# EAGLE design Device (EAGLE 9.6.2)
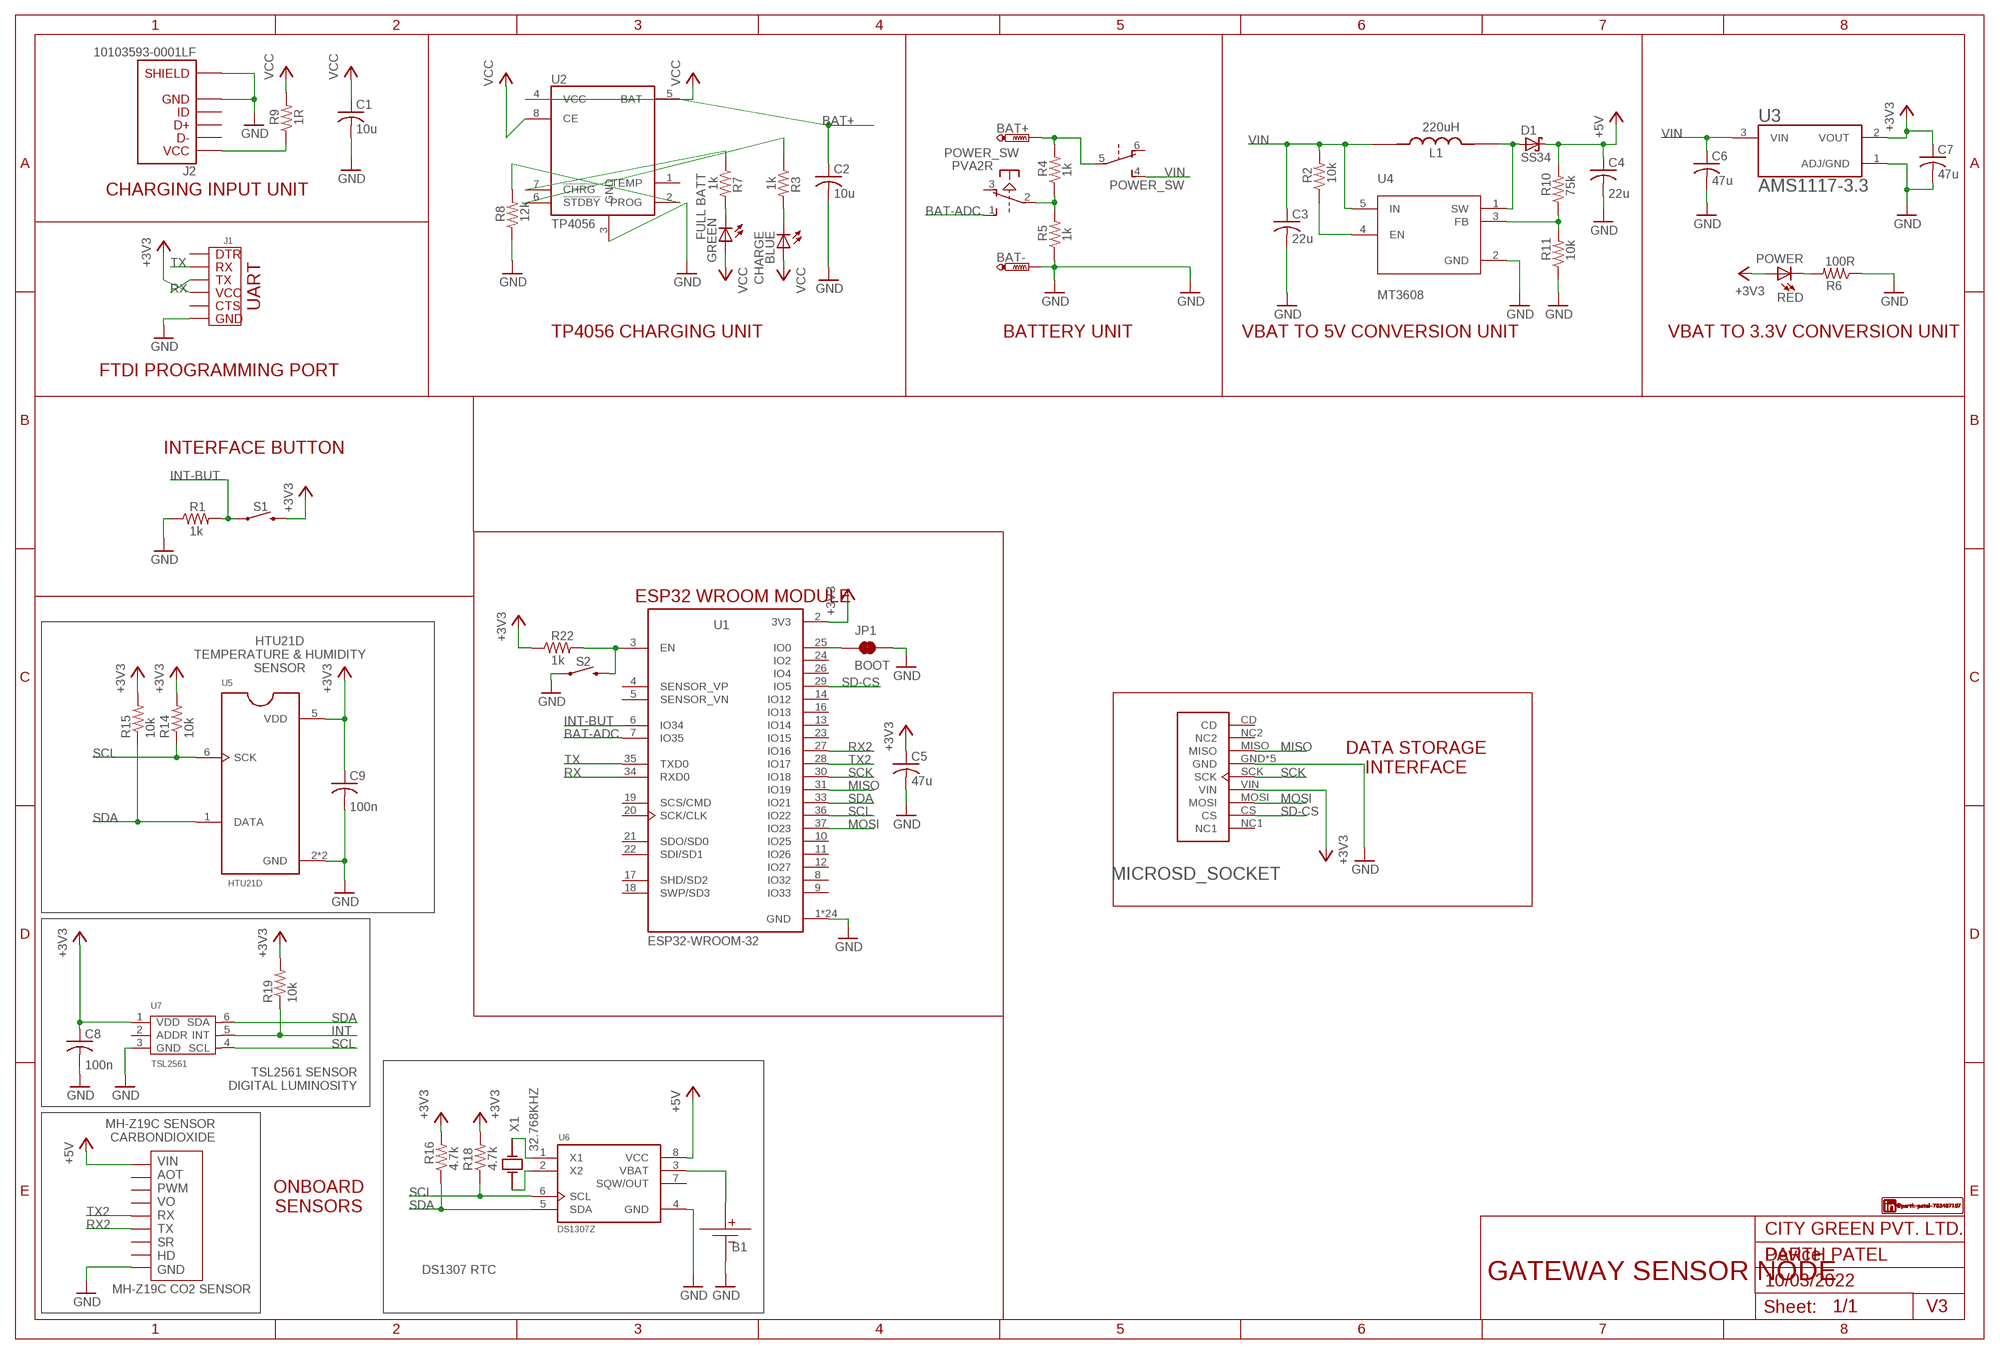
[diagram p0: schematic, sheet 1]

## Parts
B1  CR3032-METAL  [CR2032-METAL]
BAT+  PTR1TP20SQ  [TP20SQ]
BAT-  PTR1TP20SQ  [TP20SQ]
BLUE  CHARGE  LEDCHIP-LED0603  [CHIP-LED0603]
C1  10u  C-USC0805  [C0805]
C2  10u  C-USC0805  [C0805]
C3  22u  C-USC0805  [C0805]
C4  22u  C-USC0805  [C0805]
C5  47u  C-USC0805  [C0805]
C6  47u  C-USC0805  [C0805]
C7  47u  C-USC0805  [C0805]
C8  100n  C-USC0805  [C0805]
C9  100n  C-USC0805  [C0805]
D1  SS34  [DO214]
GREEN  FULL BATT  LEDCHIP-LED0603  [CHIP-LED0603]
J1  UART  [UART]
J2  10103593-0001LF  [AMPHENOL_10103593-0001LF]
JP1  BOOT  JUMPER-SMT_2_NC_TRACE_NO-SILK  [SMT-JUMPER_2_NC_TRACE_NO-SILK]
L1  220uH  #B953AS-221M=P3  [IND_#B953AS-221M=P3]
MICROSD_SOCKET  ST-TF-003A  [SUNTECH_ST-TF-003A]
POWER_SW  PVA2R  [PVA2R]
R1  1k  R-US_R0805  [R0805]
R2  10k  R-US_R0805  [R0805]
R3  1k  R-US_R0805  [R0805]
R4  1k  R-US_R0805  [R0805]
R5  1k  R-US_R0805  [R0805]
R6  100R  R-US_R0805  [R0805]
R7  1k  R-US_R0805  [R0805]
R8  12k  R-US_R0805  [R0805]
R9  1R  R-US_R0805  [R0805]
R10  75k  R-US_R0805  [R0805]
R11  10k  R-US_R0805  [R0805]
R14  10k  R-US_R0805  [R0805]
R15  10k  R-US_R0805  [R0805]
R16  4.7k  R-US_R0805  [R0805]
R18  4.7k  R-US_R0805  [R0805]
R19  10k  R-US_R0805  [R0805]
R22  1k  R-US_R0805  [R0805]
RED  POWER  LEDCHIP-LED0603  [CHIP-LED0603]
S1  MOMENTARY-SWITCH-SPST-SMD-6.2MM-TALL  [TACTILE_SWITCH_SMD_6.2MM_TALL]
S2  RST  MOMENTARY-SWITCH-SPST-SMD-6.2MM-TALL  [TACTILE_SWITCH_SMD_6.2MM_TALL]
U1  ESP32-WROOM-32  [MODULE_ESP32-WROOM-32]
U2  TP4056  [SOP127P600X175-9N]
U3  AMS1117-3.3  [SOT229P700X180-4N]
U4  MT3608  [SOT95P280X145-6N]
U5  HTU21D  [QFN100P300X300X100-7N]
U6  DS1307Z  [SOIC127P600X175-8N]
U7  TSL2561  OPTICAL-TSL2561T(6P-3.8X2.6MM)  [TMB6-1.55-3.8X2.6MM]
U$1  MH-Z19C  [MH-Z19C]
X1  32.768KHZ  AB38T-32.768KHZ  [XTAL_AB38T-32.768KHZ]

## Nets
+3V3: C5.1 C7.1 C8.1 C9.1 J1.VCC MICROSD_SOCKET.VIN R14.2 R15.2 R16.2 R18.2 R19.2 R22.1 RED.A S1.B2 U1.2(3V3) U3.2(VOUT) U5.5(VDD) U7.1(VDD)
+5V: C4.1 D1.C R10.2 U6.8(VCC) U$1.VIN
BAT+: BAT+.TP C2.1 POWER_SW.5(2:P) R4.2 U2.5(BAT)
BAT-ADC: POWER_SW.1(1:S) U1.7(IO35)
BAT-ADC-IN: POWER_SW.2(1:P) R4.1 R5.2
GND: B1.-VE1(-VE) B1.-VE2(-VE) BAT-.TP C1.2 C2.2 C3.2 C4.2 C5.2 C6.2 C7.2 C8.2 C9.2 J1.GND J2.5 J2.S1(SHIELD) J2.S2(SHIELD) J2.S3(SHIELD) J2.S4(SHIELD) J2.S5(SHIELD) J2.S6(SHIELD) JP1.2 MICROSD_SOCKET.GND MICROSD_SOCKET.GND2(GND) MICROSD_SOCKET.GND3(GND) MICROSD_SOCKET.GND4(GND) MICROSD_SOCKET.GND5(GND) R1.1 R5.1 R6.1 R8.1 R11.1 S2.A2 U1.1(GND) U1.15(GND) U1.38(GND) U1.39_1(GND) U1.39_2(GND) U1.39_3(GND) U1.39_4(GND) U1.39_5(GND) U1.39_6(GND) U1.39_7(GND) U1.39_8(GND) U1.39_9(GND) U1.39_10(GND) U1.39_11(GND) U1.39_12(GND) U1.39_13(GND) U1.39_14(GND) U1.39_15(GND) U1.39_16(GND) U1.39_17(GND) U1.39_18(GND) U1.39_19(GND) U1.39_20(GND) U1.39_21(GND) U2.3(GND) U3.1(ADJ/GND) U4.2(GND) U5.2(GND) U5.PAD(GND) U6.4(GND) U7.3(GND) U$1.GND
INT: R19.1 U7.5(INT)
INT-BUT: R1.2 S1.A2 U1.6(IO34)
MISO: MICROSD_SOCKET.MISO U1.31(IO19)
MOSI: MICROSD_SOCKET.MOSI U1.37(IO23)
N$1: R8.2 U2.2(PROG)
N$2: R6.2 RED.C
N$3: J2.1 R9.1
N$4: B1.+VE U6.3(VBAT)
N$5: R2.1 U4.4(EN)
N$6: R3.1 U2.6(!STDBY)
N$7: R7.1 U2.7(!CHRG)
N$8: BLUE.C R3.2
N$9: GREEN.C R7.2
N$11: D1.A L1.2 U4.1(SW)
N$12: R10.1 R11.2 U4.3(FB)
N$13: JP1.1 U1.25(IO0)
N$14: U6.2(X2) X1.1
N$15: R22.2 S2.B2 U1.3(EN)
N$16: U6.1(X1) X1.2
RX: J1.TX U1.34(RXD0)
RX2: U1.27(IO16) U$1.TX
SCK: MICROSD_SOCKET.SCK U1.30(IO18)
SCL: R14.1 R18.1 U1.36(IO22) U5.6(SCK) U6.6(SCL) U7.4(SCL)
SD-CS: MICROSD_SOCKET.CS U1.29(IO5)
SDA: R15.1 R16.1 U1.33(IO21) U5.1(DATA) U6.5(SDA) U7.6(SDA)
TX: J1.RX U1.35(TXD0)
TX2: U1.28(IO17) U$1.RX
VCC: BLUE.A C1.1 GREEN.A R9.2 U2.4(VCC) U2.8(CE)
VIN: C3.1 C6.1 L1.1 POWER_SW.4(2:S) R2.2 U3.3(VIN) U4.5(IN)
Unconnected: J1.CTS J1.DTR J2.2 J2.3 J2.4 MICROSD_SOCKET.CD MICROSD_SOCKET.NC1 MICROSD_SOCKET.NC2 POWER_SW.3(1:O) POWER_SW.6(2:O) U1.4(SENSOR_VP) U1.5(SENSOR_VN) U1.8(IO32) U1.9(IO33) U1.10(IO25) U1.11(IO26) U1.12(IO27) U1.13(IO14) U1.14(IO12) U1.16(IO13) U1.17(SHD/SD2) U1.18(SWP/SD3) U1.19(SCS/CMD) U1.20(SCK/CLK) U1.21(SDO/SD0) U1.22(SDI/SD1) U1.23(IO15) U1.24(IO2) U1.26(IO4) U2.1(TEMP) U6.7(SQW/OUT) U7.2(ADDR) U$1.AOT U$1.HD U$1.PWM U$1.SR U$1.VO

## Notes on the sheet
- CHARGING INPUT UNIT
- TP4056 CHARGING UNIT | BATTERY UNIT | VBAT TO 5V CONVERSION UNIT | VBAT TO 3.3V CONVERSION UNIT
- FTDI PROGRAMMING PORT
- INTERFACE BUTTON
- ESP32 WROOM MODULE
- HTU21D
  TEMPERATURE & HUMIDITY
  SENSOR
- DATA STORAGE
  INTERFACE
- TSL2561 SENSOR
  DIGITAL LUMINOSITY
- MH-Z19C SENSOR
  CARBONDIOXIDE
- ONBOARD
  SENSORS
- CITY GREEN PVT. LTD.
- PARTH PATEL
- DS1307 RTC
- GATEWAY SENSOR NODE
- 10/03/2022
- V3

## Library data of the parts
B1 = Battery Holder:CR3032-METAL
BAT+ BAT- = testpad:PTR1: TEST PIN
BLUE GREEN RED = adafruit:LED: LED OSRAM: - CHIPLED LG R971, LG N971, LY N971, LG Q971, LY Q971, LO R971, LY R971 LH N974, LH R974 LS Q976, LO Q976, LY Q976 LO Q996 - Hyper CHIPLED LW Q18S LB Q993, LB Q99A, LB R99A - SideLED LS A670, LO A670, LY A670, LG A670, LP A670 LB A673, LV A673, LT A673, LW A673 LH A674 LY A675 LS A676, LA A676, LO A676, LY A676, LW A676 LS A679, LY A679, LG A679 - Hyper Micro SIDELED® LS Y876, LA Y876, LO Y876, LY Y876 LT Y87S - SmartLED LW L88C, LW L88S LB L89C, LB L89S, LG L890 LS L89K, LO L89K, LY L89K LS L896, LA L896, LO L896, LY L896 - TOPLED LS T670, LO T670, LY T670, LG T670, LP T670 LSG T670, LSP T670, LSY T670, LOP T670, LYG T670 LG T671, LOG T671, LSG T671 LB T673, LV T673, LT T673, LW T673 LH T674 LS T676, LA T676, LO T676, LY T676, LB T676, LH T676, LSB T676, LW T676 LB T67C, LV T67C, LT T67C, LS T67K, LO T67K, LY T67K, LW E67C LS E67B, LA E67B, LO E67B, LY E67B, LB E67C, LV E67C, LT E67C LW T67C LS T679, LY T679, LG T679 LS T770, LO T770, LY T770, LG T770, LP T770 LB T773, LV T773, LT T773, LW T773 LH T774 LS E675, LA E675, LY E675, LS T675 LS T776, LA T776, LO T776, LY T776, LB T776 LHGB T686 LT T68C, LB T68C - Hyper Mini TOPLED® LB M676 - Mini TOPLED Santana® LG M470 LS M47K, LO M47K, LY M47K Source: http://www.osram.convergy.de/
C1-C9 = rcl:C-US: CAPACITOR, American symbol; SPICEPREFIX: C
D1 = SS34:SS34: SS34 Schottky diode http://www.vishay.com/docs/88751/ss32.pdf Check availability <https://pricing.snapeda.com/parts/SS34/ON%20Semiconductor/view-part?ref=eda>; AVAILABILITY: In Stock; DESCRIPTION: Diode Schottky 40 V 3A Surface Mount SMC (DO-214AB); MF: ON Semiconductor; MP: SS34; PACKAGE: SMC-2 ON Semiconductor; PRICE: None; PURCHASE-URL: https://pricing.snapeda.com/search/part/SS34/?ref=eda
J1 = FTDI Adapter:UART
J2 = MicroUSB Type B Socket:10103593-0001LF: Check availability <https://pricing.snapeda.com/parts/10103593-0001LF/AMPHENOL%20ICC%20/%20FCI/view-part?ref=eda>; AVAILABILITY: In Stock; DESCRIPTION: Micro USB 2.0, Input Output Connectors, B TYPE MID-MOUNT; MF: AMPHENOL ICC / FCI; MP: 10103593-0001LF; PACKAGE: None; PRICE: None; PURCHASE-URL: https://pricing.snapeda.com/search/part/10103593-0001LF/?ref=eda
JP1 = SparkFun-Jumpers:JUMPER-SMT_2_NC_TRACE: Normally closed trace jumper This jumper has a trace between two pads so it's normally closed (NC). Use a razor knife to open the connection. For best results follow the IPC guidelines for cutting traces: Cutout at least 0.063 mm (0.005 in). Remove all loose material to clean up the cut area. Seal the cut with an approved epoxy. Reapply solder to reclose the connection.
L1 = SMD Shielded Wire Wound Power Inductor 12mm:#B953AS-221M=P3: Inductor Power Shielded Wirewound 3.9uH 30% 100KHz Ferrite 6A 0.014Ohm DCR 4949 T/R Check availability <https://pricing.snapeda.com/parts/%23B953AS-221M%3DP3/Murata/view-part?ref=eda>; AVAILABILITY: In Stock; DESCRIPTION: Inductor with Inductance: 220uH Tol. +/-20%, Package: 4949 (125125); MF: Murata; MP: #B953AS-221M=P3; PACKAGE: NONSTANDARD; PRICE: None
MICROSD_SOCKET = MicroSD Card Socket:ST-TF-003A: Micro SD Card Socket Check availability <https://pricing.snapeda.com/parts/ST-TF-003A/Suntech/view-part?ref=eda>; AVAILABILITY: Not in stock; DESCRIPTION: Micro SD Card Socket; MF: Suntech; MP: ST-TF-003A; PACKAGE: None; PRICE: None
POWER_SW = switch-misc:PVA2R: ITT SWITCH
R1-R11 R14-R16 R18 R19 R22 = rcl:R-US_: RESISTOR, American symbol; SPICEPREFIX: R
S1 S2 = SparkFun-Switches:MOMENTARY-SWITCH-SPST: Momentary Switch (Pushbutton) - SPST Normally-open (NO) SPST momentary switches (buttons, pushbuttons). Variants PTH-12MM - 12mm square, through-hole Momentary Pushbutton Switch - 12mm Square <https://www.sparkfun.com/products/9190> (COM-09190) PTH-6.0MM, PTH-6.0MM-KIT - 6.0mm square, through-hole Mini Pushbutton Switch <https://www.sparkfun.com/products/97> (COM-00097) KIT package intended for soldering kit's - only one side of pads' copper is exposed. PTH-RIGHT-ANGLE-KIT - Right-angle, through-hole Right Angle Tactile Button <https://www.sparkfun.com/products/10791> - Used on SparkFun BigTime Watch Kit <https://www.sparkfun.com/products/11734> SMD-12MM - 12mm square, surface-mount Tactile Button - SMD (12mm) <https://www.sparkfun.com/products/12993> (COM-12993) Used on SparkFun PicoBoard <https://www.sparkfun.com/products/11888> SMD-4.5MM - 4.5mm Square Trackball Switch Used on SparkFun Blackberry Trackballer Breakout <https://www.sparkfun.com/products/13169> SMD-4.6MMX2.8MM - 4.60mm x 2.80mm, surface mount Used on SparkFun SAMD21 Mini Breakout <https://www.sparkfun.com/products/13664> SMD-5.2MM, SMD-5.2-REDUNDANT - 5.2mm square, surface-mount Mini Pushbutton Switch - SMD <https://www.sparkfun.com/products/8720> (COM-08720) Used on Arduino Pro Mini <https://www.sparkfun.com/products/11114> REDUNDANT package connects both switch circuits together SMD-6.0X3.5MM - 6.0 x 3.5mm, surface mount Momentary Reset Switch SMD <https://www.sparkfun.com/products/8229> (COM-08229) SMD-6.2MM-TALL - 6.2mm square, surface mount Tactile Button - SMD (6mm) <https://www.sparkfun.com/products/12992> Used on SparkFun Digital Sandbox <https://www.sparkfun.com/products/12651> SMD-RIGHT-ANGLE - Right-angle, surface mount Used on SparkFun Block for Intel® Edison - Arduino <https://www.sparkfun.com/products/13036>; PROD_ID: SWCH-11966; SF_SKU: COM-12992
U1 = ESP32 WROOM 32:ESP32-WROOM-32: Bluetooth, WiFi Transceiver Module 2.4GHz ~ 2.5GHz Surface Mount Check availability <https://pricing.snapeda.com/parts/ESP32-WROOM-32/Espressif%20Systems/view-part?ref=eda>; AVAILABILITY: In Stock; DESCRIPTION: Bluetooth, WiFi 802.11b/g/n, Bluetooth v4.2 +EDR, Class 1, 2 and 3 Transceiver Module 2.4GHz ~ 2.5GHz Antenna Not Included, U.FL Surface Mount; MF: Espressif Systems; MP: ESP32-WROOM-32; PACKAGE: Module Espressif Systems; PRICE: None; PURCHASE-URL: https://pricing.snapeda.com/search/part/ESP32-WROOM-32/?ref=eda
U2 = TP4056:TP4056: Complete single cell Li-Ion battery with a constant current / constant voltage linear charger Check availability <https://pricing.snapeda.com/parts/TP4056/NanJing%20Top%20Power%20ASIC%20Corp./view-part?ref=eda>; AVAILABILITY: Not in stock; DESCRIPTION: Complete single cell Li-Ion battery with a constant current / constant voltage linear charger; MF: NanJing Top Power ASIC Corp.; MP: TP4056; PACKAGE: None; PRICE: None
U3 = AMS1117-3.3:AMS1117-3.3: Sot223/Pkg 1-Amp 3.3-Volt Low Drop Out Voltage Regulatator Check availability <https://pricing.snapeda.com/parts/AMS1117-3.3/AMD/view-part?ref=eda>; AVAILABILITY: Not in stock; DESCRIPTION: LDO Voltage Regulators 800MA LDO LINEAR REG; MF: AMD; MP: AMS1117-3.3; PACKAGE: None; PRICE: None
U4 = MT3608:MT3608: High Efficiency 1.2MHz 2A Step Up Converter Check availability <https://pricing.snapeda.com/parts/MT3608/Aerosemi%20Technology%20Co.%2C%20Ltd/view-part?ref=eda>; AVAILABILITY: Not in stock; DESCRIPTION: High Efficiency 1.2MHz 2A Step Up Converter; MF: Aerosemi Technology Co., Ltd; MP: MT3608; PACKAGE: Package; PRICE: None
U5 = HTU21D:HTU21D: Digital Relative Humidity sensor with Temperature output Check availability <https://pricing.snapeda.com/parts/HTU21D/TE%20Connectivity/view-part?ref=eda>; AVAILABILITY: In Stock; COMMENT: CAT-HSC0004; DESCRIPTION: HTU21D Humidity, Temperature Sensor Xplained Pro Platform Evaluation Expansion Board; MF: TE Connectivity; MP: HTU21D; PACKAGE: DFN-6 TE Connectivity; PRICE: None; PURCHASE-URL: https://pricing.snapeda.com/search/part/HTU21D/?ref=eda
U6 = DS1307Z:DS1307Z: Real Time Clock Serial 56Byte 8-Pin SOIC N Check availability <https://pricing.snapeda.com/parts/DS1307Z/Maxim%20Integrated/view-part?ref=eda>; AVAILABILITY: In Stock; DESCRIPTION: Real Time Clock (RTC) IC Clock/Calendar 56B I²C, 2-Wire Serial 8-SOIC (0.154, 3.90mm Width); MF: Maxim Integrated; MP: DS1307Z; PACKAGE: SOIC-8 Maxim; PRICE: None; PURCHASE-URL: https://pricing.snapeda.com/search/part/DS1307Z/?ref=eda
U7 = TSL2561 LUX Sensor:OPTICAL-TSL2561T(6P-3.8X2.6MM): 314020025 Check availability <https://pricing.snapeda.com/parts/TSL2561T/ams/view-part?ref=eda>; AVAILABILITY: Not in stock; DESCRIPTION: Optical Sensor Ambient 640nm I²C 6-SMD, No Lead; MF: ams; MP: TSL2561T; PACKAGE: SMD-6 TAOS; PRICE: None
U$1 = MH-Z19 Sensor:MH-Z19C
X1 = 32.768KHZ:AB38T-32.768KHZ: AB38T Series 32.768 kHz ±20 ppm 12.5 pF -10 to +60 °C Tuning Fork Crystal Check availability <https://pricing.snapeda.com/parts/AB38T-32.768KHZ/Abracon/view-part?ref=eda>; AVAILABILITY: In Stock; DESCRIPTION: 32.768 kHz ±20ppm Crystal 12.5pF 30 kOhms Cylindrical Can, Radial; MF: Abracon; MP: AB38T-32.768KHZ; PACKAGE: Cylindrical Can Radial Abracon; PRICE: None; PURCHASE-URL: https://pricing.snapeda.com/search/part/AB38T-32.768KHZ/?ref=eda

## Board
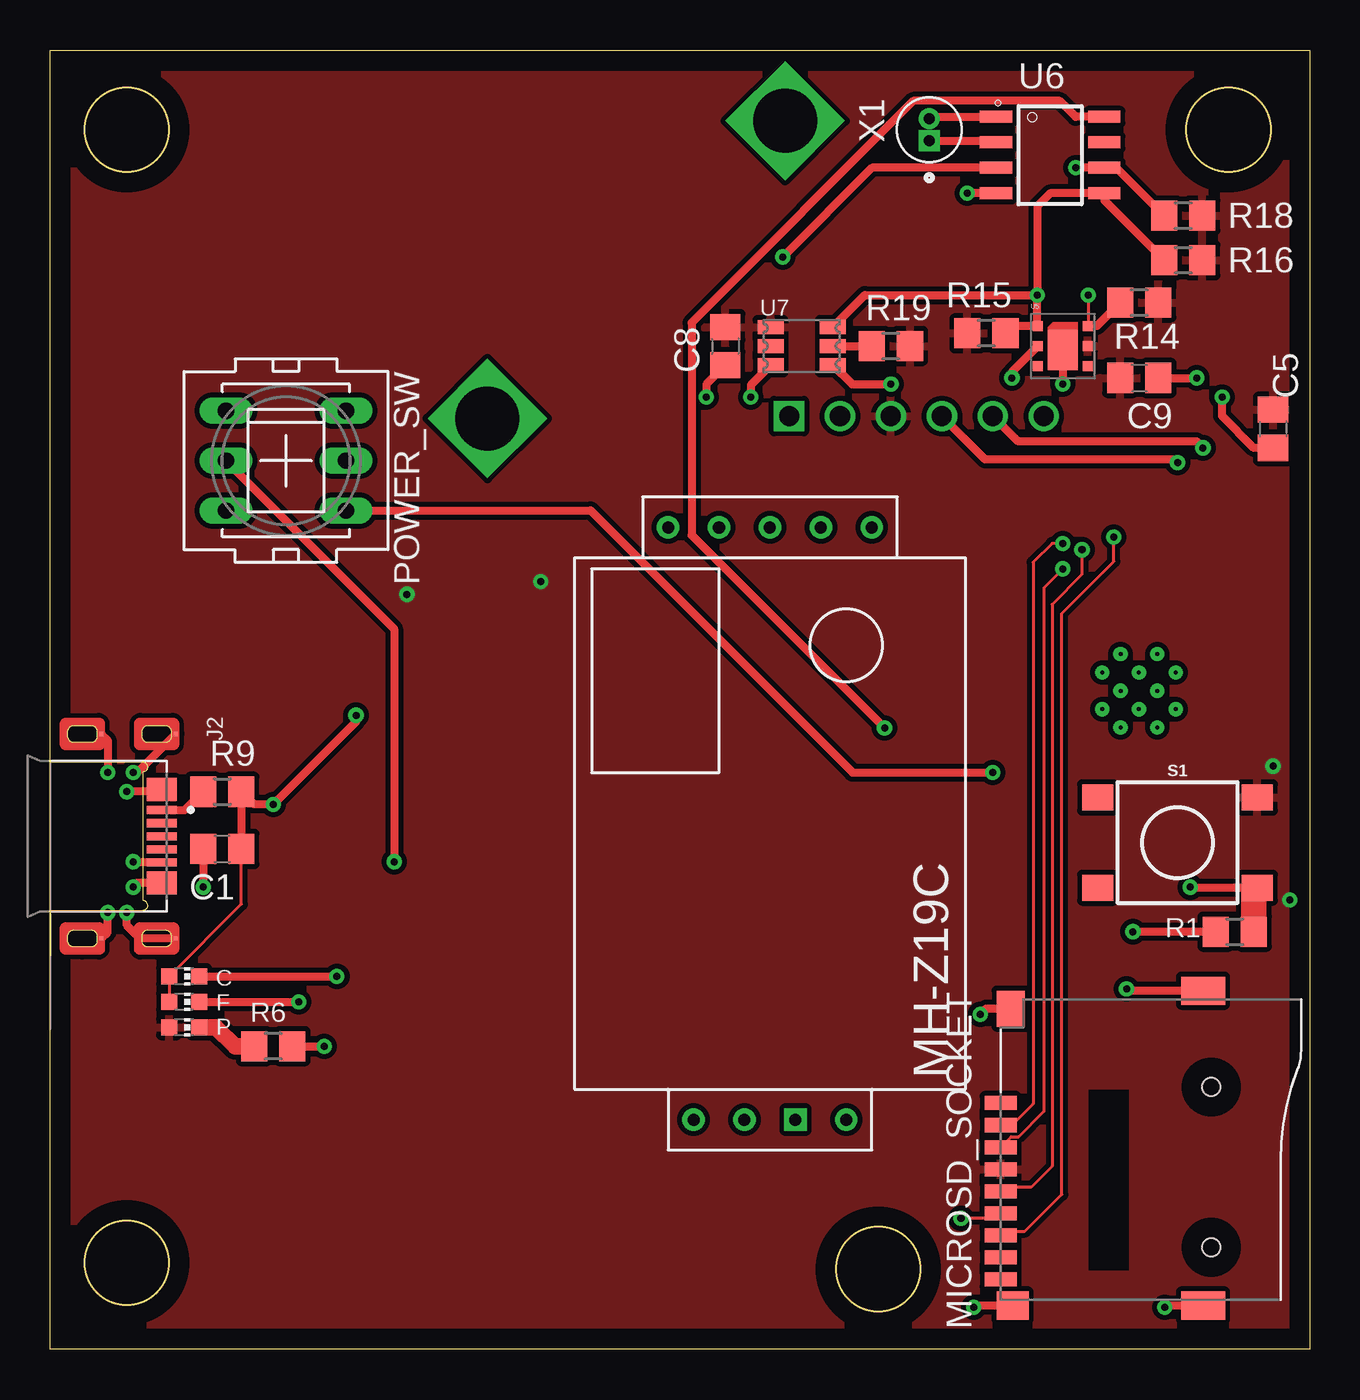
[diagram p1: board, top side]
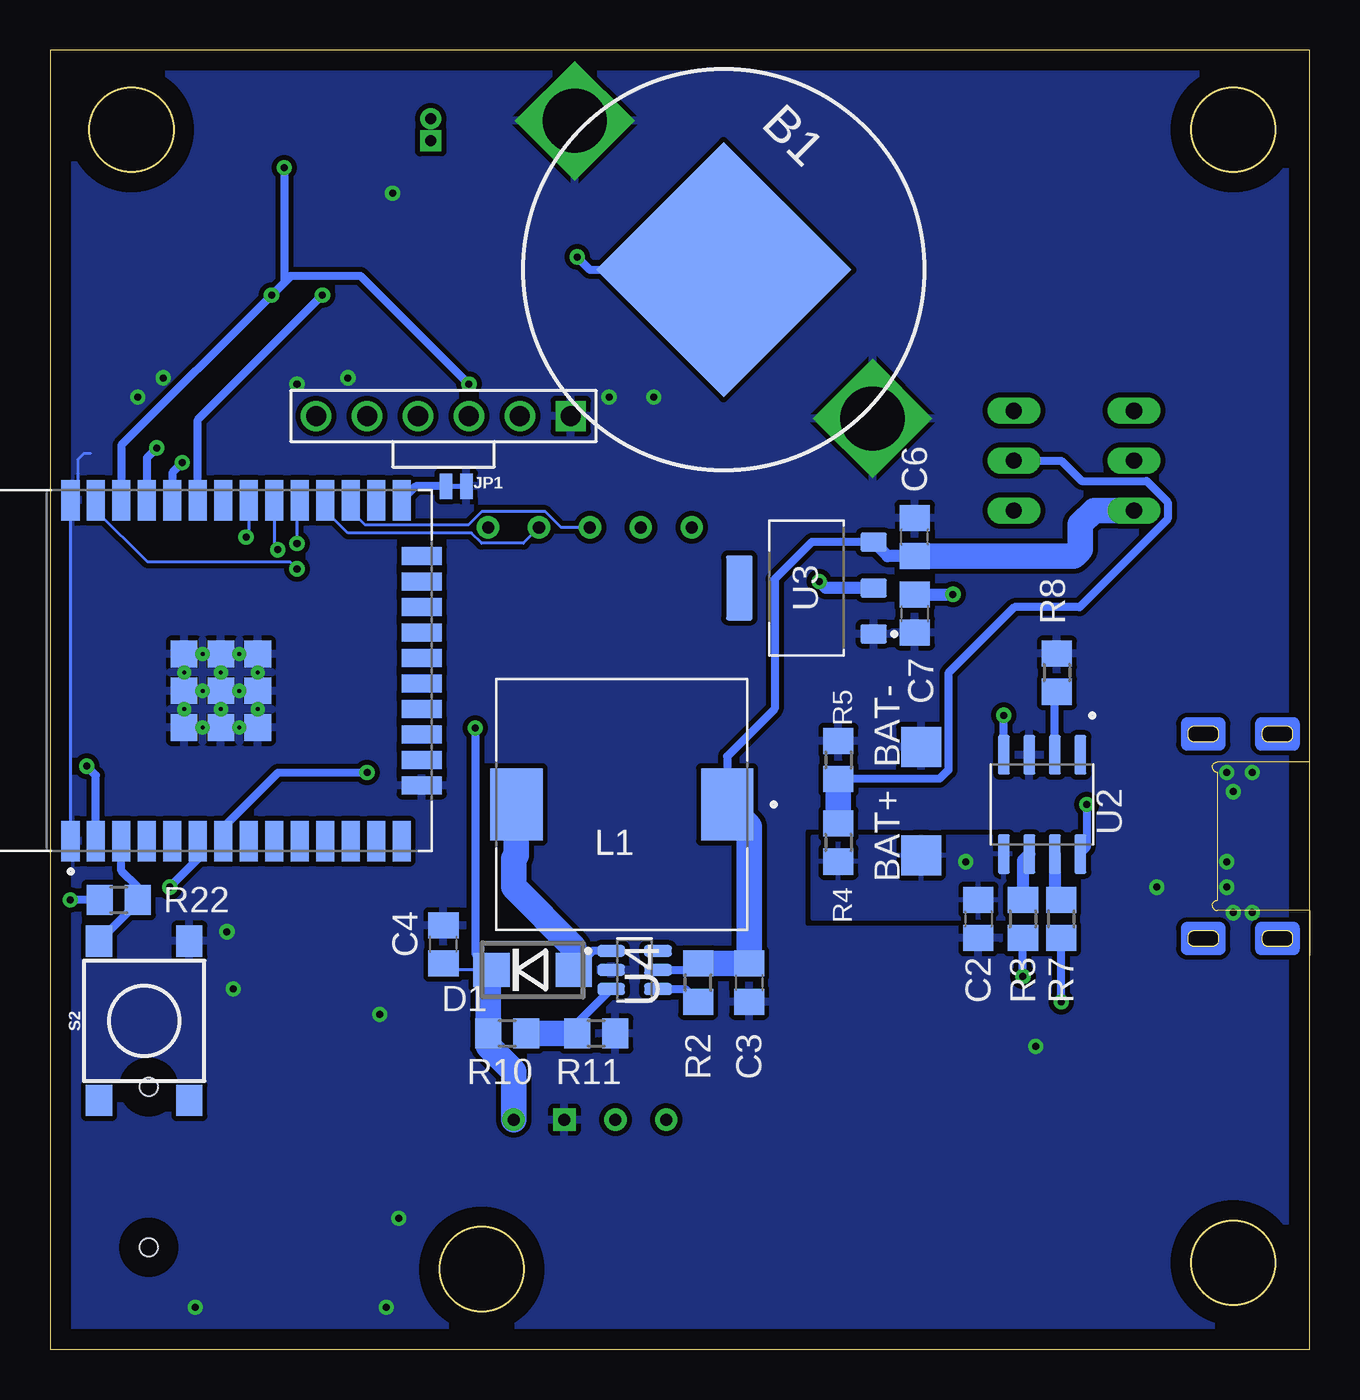
[diagram p2: board, bottom side, seen from below]

Size 62.8 x 64.8 mm. Coordinates in mm from the lower left corner, seen from the top.
Outline: 0,0 0,64.8 62.8,64.8 62.8,0 0,0
Outline: circle at 3.82,60.84 radius 2.1
Outline: circle at 58.75,60.84 radius 2.1
Outline: circle at 3.82,4.32 radius 2.1
Outline: circle at 41.28,4 radius 2.1
Copper layers (1*16): Top 0.035mm / dielectric 1.5mm / Bottom 0.035mm
Design rules "default": minimum track width 6mil, minimum drill 0.35mm, track to track 0.25mm, track to pad 6mil, pad to pad 6mil, via to via 6mil, smd to smd 6mil, copper to edge 40mil, drill to drill 6mil, minimum pad ring 10mil, minimum via ring 8mil, stop-mask expansion 4mil, vias tented up to drill 15mil, thermal gap 10mil
tRestrict: area 0.8,57.8 to 6.8,63.8; area 55.7,57.8 to 61.7,63.8; area 0.8,1.3 to 6.8,7.3; area 38.3,1 to 44.3,7
bRestrict: area 0.8,57.8 to 6.8,63.8; area 55.7,57.8 to 61.7,63.8; area 0.8,1.3 to 6.8,7.3; area 38.3,1 to 44.3,7

### Footprints (pad centres in the part's own frame; a part is rotated, then mirrored left to right if it is on the bottom)
CR2032-METAL = smd 9 x 9: +VE 0,0 | drill 3.2 square: -VE1 -10.5,0; -VE2 10.5,0
TP20SQ = smd 2 x 2: TP 0,0
CHIP-LED0603 = smd 0.8 x 0.8: A 0,-0.75; C 0,0.75
C0805 = smd 1.3 x 1.5: 1 -0.95,0; 2 0.95,0
DO214 = smd 1.8 x 1.7: A 2.05,0; C -2.05,0
UART = drill 1: CTS 3.81,0; DTR -6.35,0; RX -3.81,0; TX -1.27,0; VCC 1.27,0 | drill 1 square: GND 6.35,0
AMPHENOL_10103593-0001LF = smd 0.4 x 1.5: 1 -1.3,5.55; 2 -0.65,5.55; 3 0,5.55; 4 0.65,5.55; 5 1.3,5.55 | smd 1.15 x 1.5: S1 -2.325,5.55; S2 2.325,5.55 | smd 0.2 x 0.2: S3 -5.1,6.25; S4 5.1,6.25; S5 -5.1,2.55; S6 5.1,2.55
SMT-JUMPER_2_NC_TRACE_NO-SILK = smd 0.635 x 1.27: 1 -0.508,0; 2 0.508,0
IND_#B953AS-221M=P3 = smd 2.6 x 3.6: 1 -5.25,0; 2 5.25,0
SUNTECH_ST-TF-003A = smd 0.7 x 1.6: CD -5.28,5.33; CS 2.42,5.33; GND5 -1.98,5.33; MISO -3.08,5.33; MOSI 1.32,5.33; NC1 3.52,5.33; NC2 -4.18,5.33; SCK -0.88,5.33; VIN 0.22,5.33 | smd 1.4 x 1.6: GND -6.58,4.73 | smd 1.8 x 1.4: GND2 8.22,4.83 | smd 1.4 x 2.2: GND3 9.12,-4.77; GND4 -6.58,-4.77 | hole 0.9: -3.68,-5.17; 4.32,-5.17
PVA2R = drill 0.813 long: 1 -2.997,2.489; 2 -2.997,0; 3 -2.997,-2.489; 4 2.997,2.489; 5 2.997,0; 6 2.997,-2.489
R0805 = smd 1.3 x 1.5: 1 -0.95,0; 2 0.95,0
TACTILE_SWITCH_SMD_6.2MM_TALL = smd 1.55 x 1.3: A1 -3.975,-2.25; A2 3.975,-2.25; B1 -3.975,2.25; B2 3.975,2.25
MODULE_ESP32-WROOM-32 = smd 2 x 0.9: 1 -8.5,5.26; 2 -8.5,3.99; 3 -8.5,2.72; 4 -8.5,1.45; 5 -8.5,0.18; 6 -8.5,-1.09; 7 -8.5,-2.36; 8 -8.5,-3.63; 9 -8.5,-4.9; 10 -8.5,-6.17; 11 -8.5,-7.44; 12 -8.5,-8.71; 13 -8.5,-9.98; 14 -8.5,-11.25; 25 8.5,-11.25; 26 8.5,-9.98; 27 8.5,-8.71; 28 8.5,-7.44; 29 8.5,-6.17; 30 8.5,-4.9; 31 8.5,-3.63; 32 8.5,-2.36; 33 8.5,-1.09; 34 8.5,0.18; 35 8.5,1.45; 36 8.5,2.72; 37 8.5,3.99; 38 8.5,5.26 | smd 0.9 x 2: 15 -5.715,-12.25; 16 -4.445,-12.25; 17 -3.175,-12.25; 18 -1.905,-12.25; 19 -0.635,-12.25; 20 0.635,-12.25; 21 1.905,-12.25; 22 3.175,-12.25; 23 4.445,-12.25; 24 5.715,-12.25 | smd 1.33 x 1.33: 39_1 -2.835,-0.405; 39_2 -1,-0.405; 39_3 0.835,-0.405; 39_4 -2.835,-2.24; 39_5 -1,-2.24; 39_6 0.835,-2.24; 39_7 -2.835,-4.075; 39_8 -1,-4.075; 39_9 0.835,-4.075 | drill 0.2 pad 0.3: 39_10 -1.917,-0.405; 39_11 -0.083,-0.405; 39_12 -2.835,-1.323; 39_13 -1,-1.323; 39_14 0.835,-1.323; 39_15 -1.917,-2.24; 39_16 -0.083,-2.24; 39_17 -2.835,-3.158; 39_18 -1,-3.158; 39_19 0.835,-3.158; 39_20 -1.917,-4.075; 39_21 -0.083,-4.075
SOP127P600X175-9N = smd 1.97 x 0.6: 1 -2.475,1.905; 2 -2.475,0.635; 3 -2.475,-0.635; 4 -2.475,-1.905; 5 2.475,-1.905; 6 2.475,-0.635; 7 2.475,0.635; 8 2.475,1.905
SOT229P700X180-4N = smd 0.93 x 1.31: 1 -2.29,-3.345; 2 0,-3.345; 3 2.29,-3.345 | smd 3.24 x 1.31: 4 0,3.345
SOT95P280X145-6N = smd 1.37 x 0.59: 1 -1.17,0.95; 2 -1.17,0; 3 -1.17,-0.95; 4 1.17,-0.95; 5 1.17,0; 6 1.17,0.95
QFN100P300X300X100-7N = smd 0.5 x 0.5: 1 -1.25,1; 2 -1.25,0; 3 -1.25,-1; 4 1.25,-1; 5 1.25,0; 6 1.25,1 | smd 1.5 x 2: PAD 0,-0.2
SOIC127P600X175-8N = smd 1.6 x 0.6: 1 -2.7,1.905; 2 -2.7,0.635; 3 -2.7,-0.635; 4 -2.7,-1.905; 5 2.7,-1.905; 6 2.7,-0.635; 7 2.7,0.635; 8 2.7,1.905
TMB6-1.55-3.8X2.6MM = smd 1.3 x 0.7: 1 -1.55,0.95; 2 -1.55,0; 3 -1.55,-0.95; 4 1.55,-0.95; 5 1.55,0; 6 1.55,0.95
MH-Z19C = drill 0.6: AOT -14.77,1.27; HD 14.77,5.08; PWM -14.77,3.81; RX 14.77,-2.54; SR 14.77,2.54; TX 14.77,0; VIN -14.77,-3.81; VO 14.77,-5.08 | drill 0.6 square: GND -14.77,-1.27
XTAL_AB38T-32.768KHZ = drill 0.55 pad 0.7 square: 1 -0.55,0 | drill 0.55 pad 0.7: 2 0.55,0

### Placement (x,y rotation side)
B1  29.22,53.85 315 bottom
BAT+  19.38,24.64 90 bottom
BAT-  19.38,30.04 90 bottom
BLUE  6.68,18.61 270 top
C1  8.58,24.96 180 top
C2  16.52,21.46 270 bottom
C3  27.95,18.29 270 bottom
C4  43.19,20.2 90 bottom
C5  60.97,45.91 270 top
C6  19.7,40.52 90 bottom
C7  19.7,36.71 270 bottom
C8  33.66,50.04 270 top
C9  54.3,48.45 0 top
D1  38.74,18.93 0 bottom
GREEN  6.68,17.34 270 top
J1  43.19,46.55 0 bottom
J2  0.01,25.59 270 top
JP1  42.55,43.05 0 bottom
L1  34.3,27.18 180 bottom
MICROSD_SOCKET  52.71,8.77 90 top
POWER_SW  11.76,44.33 180 top
R1  59.06,20.83 0 top
R2  30.49,18.29 90 bottom
R3  14.3,21.46 270 bottom
R4  23.51,25.27 270 bottom
R5  23.51,29.4 270 bottom
R6  11.12,15.11 180 top
R7  12.39,21.46 270 bottom
R8  12.61,33.75 270 bottom
R9  8.58,27.81 0 top
R10  40.02,15.75 180 bottom
R11  35.57,15.75 180 bottom
R14  54.3,52.21 0 top
R15  46.68,50.68 180 top
R16  56.49,54.33 0 top
R18  56.49,56.55 0 top
R19  41.92,50.04 0 top
R22  59.38,22.42 0 bottom
RED  6.68,16.07 270 top
S1  56.21,25.27 0 top
S2  58.11,16.39 90 bottom
U1  56.52,33.85 90 bottom
U2  13.35,27.18 270 bottom
U3  25.09,37.98 90 bottom
U4  33.66,18.93 0 bottom
U5  50.49,50.04 0 top
U6  49.86,59.57 0 top
U7  37.48,50.04 0 top
U$1  35.89,26.23 90 top
X1  43.82,60.84 90 top

### Tracks (layer width: path | path; a pad name or v marks a point on that pad's centre or on a via)
+3V3  (via drill 0.35)
  Bottom 0.406: U1.2 60.52,28.63 v60.97,29.09 | R22.1 v61.8,22.42
  Bottom 0.61: U3.2 24.14,37.98 v24.46,38.29 | C7.1 v17.79,37.66
  pour Top (rank 6): -3.8,66.55 -3.8,-2.03 66.05,-2.03 66.05,66.55
+5V  (via drill 0.35)
  Top 0.406: U6.8 51.13,61.47 50.33,62.27 43.04,62.27 31.98,51.21 31.98,40.61 v41.6,30.99
  Bottom 0.152: D1.C 42.87,18.93 C4.1
  Bottom 0.406: v41.6,30.99 41.6,19.73 D1.C
  Bottom 1.27: D1.C 40.96,18.75 R10.2 40.96,15.14 39.7,13.87 U$1.VIN
BAT+  (via drill 0.35)
  Top 0.406: v17.16,24.32 17.16,35.93 POWER_SW.5
  pour Bottom: 14.93,25.59 14.93,21.78 15.25,21.46 24.77,21.46 24.77,25.59
BAT-ADC  (via drill 0.35)
  Top 0.406: POWER_SW.1 26.95,41.84 40.02,28.77 v47,28.77
  Bottom 0.406: U1.7 54.16,26.03 51.43,28.77 v47,28.77
BAT-ADC-IN
  Bottom 0.406: POWER_SW.2 12.39,44.33 11.38,43.31 8.14,43.31 7.08,42.26 7.08,41.42 11.48,37.02 14.73,37.02 18.02,33.73 18.02,28.89 18.46,28.45 R5.2
  Bottom 1.27: R4.1 R5.2
GND  (via drill 0.35)
  Top 0.152: MICROSD_SOCKET.GND5 47.14,6.54 v45.41,6.54
  Top 0.406: C1.2 7.63,23.37 v7.63,23.05 | MICROSD_SOCKET.GND 46.13,2.19 v46.05,2.1 | MICROSD_SOCKET.GND4 55.66,2.19 v55.57,2.1 | MICROSD_SOCKET.GND2 46.65,16.98 v46.37,16.7 | MICROSD_SOCKET.GND3 53.75,17.88 v53.67,17.97 | C5.2 60.02,44.96 58.43,46.55 v58.43,47.5 | R1.1 v53.98,20.83 | R6.1 v13.66,15.11 | U5.2 48.85,49.65 48.84,49.65 47.95,48.75 v47.95,48.45 | U5.PAD v50.49,48.14 | U6.4 v45.73,57.66 | C9.2 v57.16,48.45 | C8.2 32.71,48.14 v32.71,47.5 | U7.3 34.94,48.1 v34.94,47.5 | J2.5 4.17,24.29 v4.14,24.32 | J2.S2 4.35,23.27 v4.14,23.05 | J2.S5 2.87,30.38 v2.87,28.77 | J2.S3 4.33,28.77 v4.14,28.77 | J2.S1 5.46,27.81 v3.82,27.81 | J2.S6 2.87,20.8 v2.87,21.78 | J2.S4 4.48,20.49 3.82,21.15 v3.82,21.78
  Bottom 0.152: 60.8,44.7 61.1,44.7 61.4,44.4 61.4,42.73 U1.38 U1.1
  pour Bottom (rank 6): -6.34,67.82 -6.34,-4.57 68.59,-4.57 68.59,67.82
INT
  Top 0.406: U7.5 R19.1
INT-BUT  (via drill 0.35)
  Top 0.406: S1.A2 56.87,23.02 v56.84,23.05
  Top 1.27: S1.A2 60.02,22.86 R1.2
  Bottom 0.406: v56.84,23.05 55.43,24.46 U1.6
MISO  (via drill 0.35)
  Top 0.152: MICROSD_SOCKET.MISO 47.59,5.89 48.6,5.89 50.44,7.73 50.44,36.71 53.03,39.3 v53.03,40.52
  Bottom 0.152: U1.31 52.89,40.65 v53.03,40.52
MOSI  (via drill 0.35)
  Top 0.152: MICROSD_SOCKET.MOSI 47.91,10.61 48.28,10.61 49.54,11.87 49.54,37.98 v50.49,38.93
  Bottom 0.152: v50.49,38.93 50.84,39.27 57.94,39.27 60.52,41.84 60.52,42.1
  Bottom 0.406: 60.52,42.1 U1.37
N$1
  Bottom 0.406: U2.2 12.71,32.7 R8.2
N$2
  Top 0.813: RED.C 8.27,16.07 9.22,15.11 R6.2
N$3
  Top 0.406: J2.1 6.71,26.89 R9.1
N$4  (via drill 0.35)
  Top 0.406: U6.3 40.97,58.93 v36.52,54.48
  Bottom 0.406: v36.52,54.48 35.89,53.85 B1.+VE
N$5
  Bottom 0.406: U4.4 31.12,17.97 R2.1
N$6
  Bottom 0.61: U2.6 14.3,24.39 R3.1
N$7
  Bottom 0.61: U2.7 12.71,22.73 R7.1
N$8  (via drill 0.35)
  Top 0.406: BLUE.C v14.3,18.61
  Bottom 0.406: v14.3,18.61 R3.2
N$9  (via drill 0.35)
  Top 0.406: GREEN.C v12.39,17.34
  Bottom 0.406: v12.39,17.34 R7.2
N$11
  Bottom 0.406: U4.1 35.74,19.88 D1.A
  Bottom 1.27: D1.A 36.7,20.05 39.7,23.05 39.7,24.49 39.55,24.64 L1.2
N$12
  Bottom 0.406: U4.3 36.52,16.29 R11.2
  Bottom 1.27: R11.2 R10.1
N$13
  Bottom 0.406: JP1.1 44.57,43.05 U1.25
N$14
  Top 0.406: X1.1 47.07,60.29 U6.2
N$15
  Bottom 0.406: S2.B2 58.43,22.29 R22.2 58.43,23.05 59.24,23.87 U1.3
N$16
  Top 0.406: X1.2 43.91,61.47 U6.1
RX  (via drill 0.35)
  Top 0.406: J1.TX 46.61,44.4 56.03,44.4 v56.21,44.23
  Bottom 0.406: v56.21,44.23 56.7,43.73 U1.34
RX2
  Bottom 0.152: U$1.TX 37.32,41 38.1,41.78 41.29,41.78 41.95,41.12 47.09,41.12 47.81,41.84 47.81,42.1
  Bottom 0.406: 47.81,42.1 U1.27
SCK  (via drill 0.35)
  Top 0.152: MICROSD_SOCKET.SCK 47.59,8.09 48.91,8.09 49.96,9.13 49.96,37.16 51.45,38.65 v51.45,39.88
  Bottom 0.152: U1.30 51.62,40.06 v51.45,39.88
SCL  (via drill 0.35)
  Top 0.152: v51.76,52.58 51.76,51.06 U5.6 52.18,51.04
  Top 0.406: 52.18,51.04 R14.1 | U7.4 39.98,48.14 v41.92,48.14 | R18.1 53.16,58.93 U6.6 v51.13,58.93
  Bottom 0.406: v51.76,52.58 59.24,45.1 U1.36 | v41.92,48.14 47.32,53.53 50.81,53.53 v51.76,52.58 | v51.13,58.93 51.13,53.22 v51.76,52.58
SD-CS  (via drill 0.35)
  Top 0.152: 47.94,11.18 49.01,12.26 49.01,39.26 49.95,40.2 v50.49,40.2
  Top 0.406: 47.94,11.18 MICROSD_SOCKET.CS
  Bottom 0.152: U1.29 50.49,42.21 v50.49,40.2
SDA  (via drill 0.35)
  Top 0.406: R15.1 48,51.04 U5.1 49.22,51.06 v49.22,52.58 | U7.6 40.62,52.58 v49.22,52.58 | R16.1 52.56,57.31 U6.5 49.86,57.66 49.22,57.03 v49.22,52.58
  Bottom 0.406: v49.22,52.58 55.43,46.37 U1.33
TX  (via drill 0.35)
  Top 0.406: J1.RX 48.27,45.28 57.16,45.28 v57.48,44.96
  Bottom 0.406: v57.48,44.96 57.98,44.46 U1.35
TX2
  Bottom 0.152: 49.09,42.1 49.09,41.84 47.96,40.72 41.79,40.72 41.29,40.22 39.21,40.22 U$1.RX
  Bottom 0.406: 49.09,42.1 U1.28
VCC  (via drill 0.35)
  Top 0.152: C1.1 9.53,22.21 BLUE.A GREEN.A
  Top 0.406: v15.25,31.62 15.25,31.31 v11.12,27.18 10.17,27.18 R9.2 C1.1
  Bottom 0.406: U2.8 11.12,25.02 v11.12,27.18 | U2.4 v15.25,31.62
VIN
  Bottom 0.406: U4.5 30.8,18.93 R2.2 | L1.1 29.05,29.57 26.68,31.94 26.68,38.41 24.83,40.27 U3.3
  Bottom 0.61: C6.1 21.05,39.57 U3.3
  Bottom 1.27: L1.1 27.95,26.08 C3.1 R2.2 | C6.1 11.76,39.57 11.44,39.88 11.44,41.15 10.75,41.84 POWER_SW.4

### Text on the board
tNames: C / F / P